# EAGLE design TC_TFT (EAGLE 9.6.2)
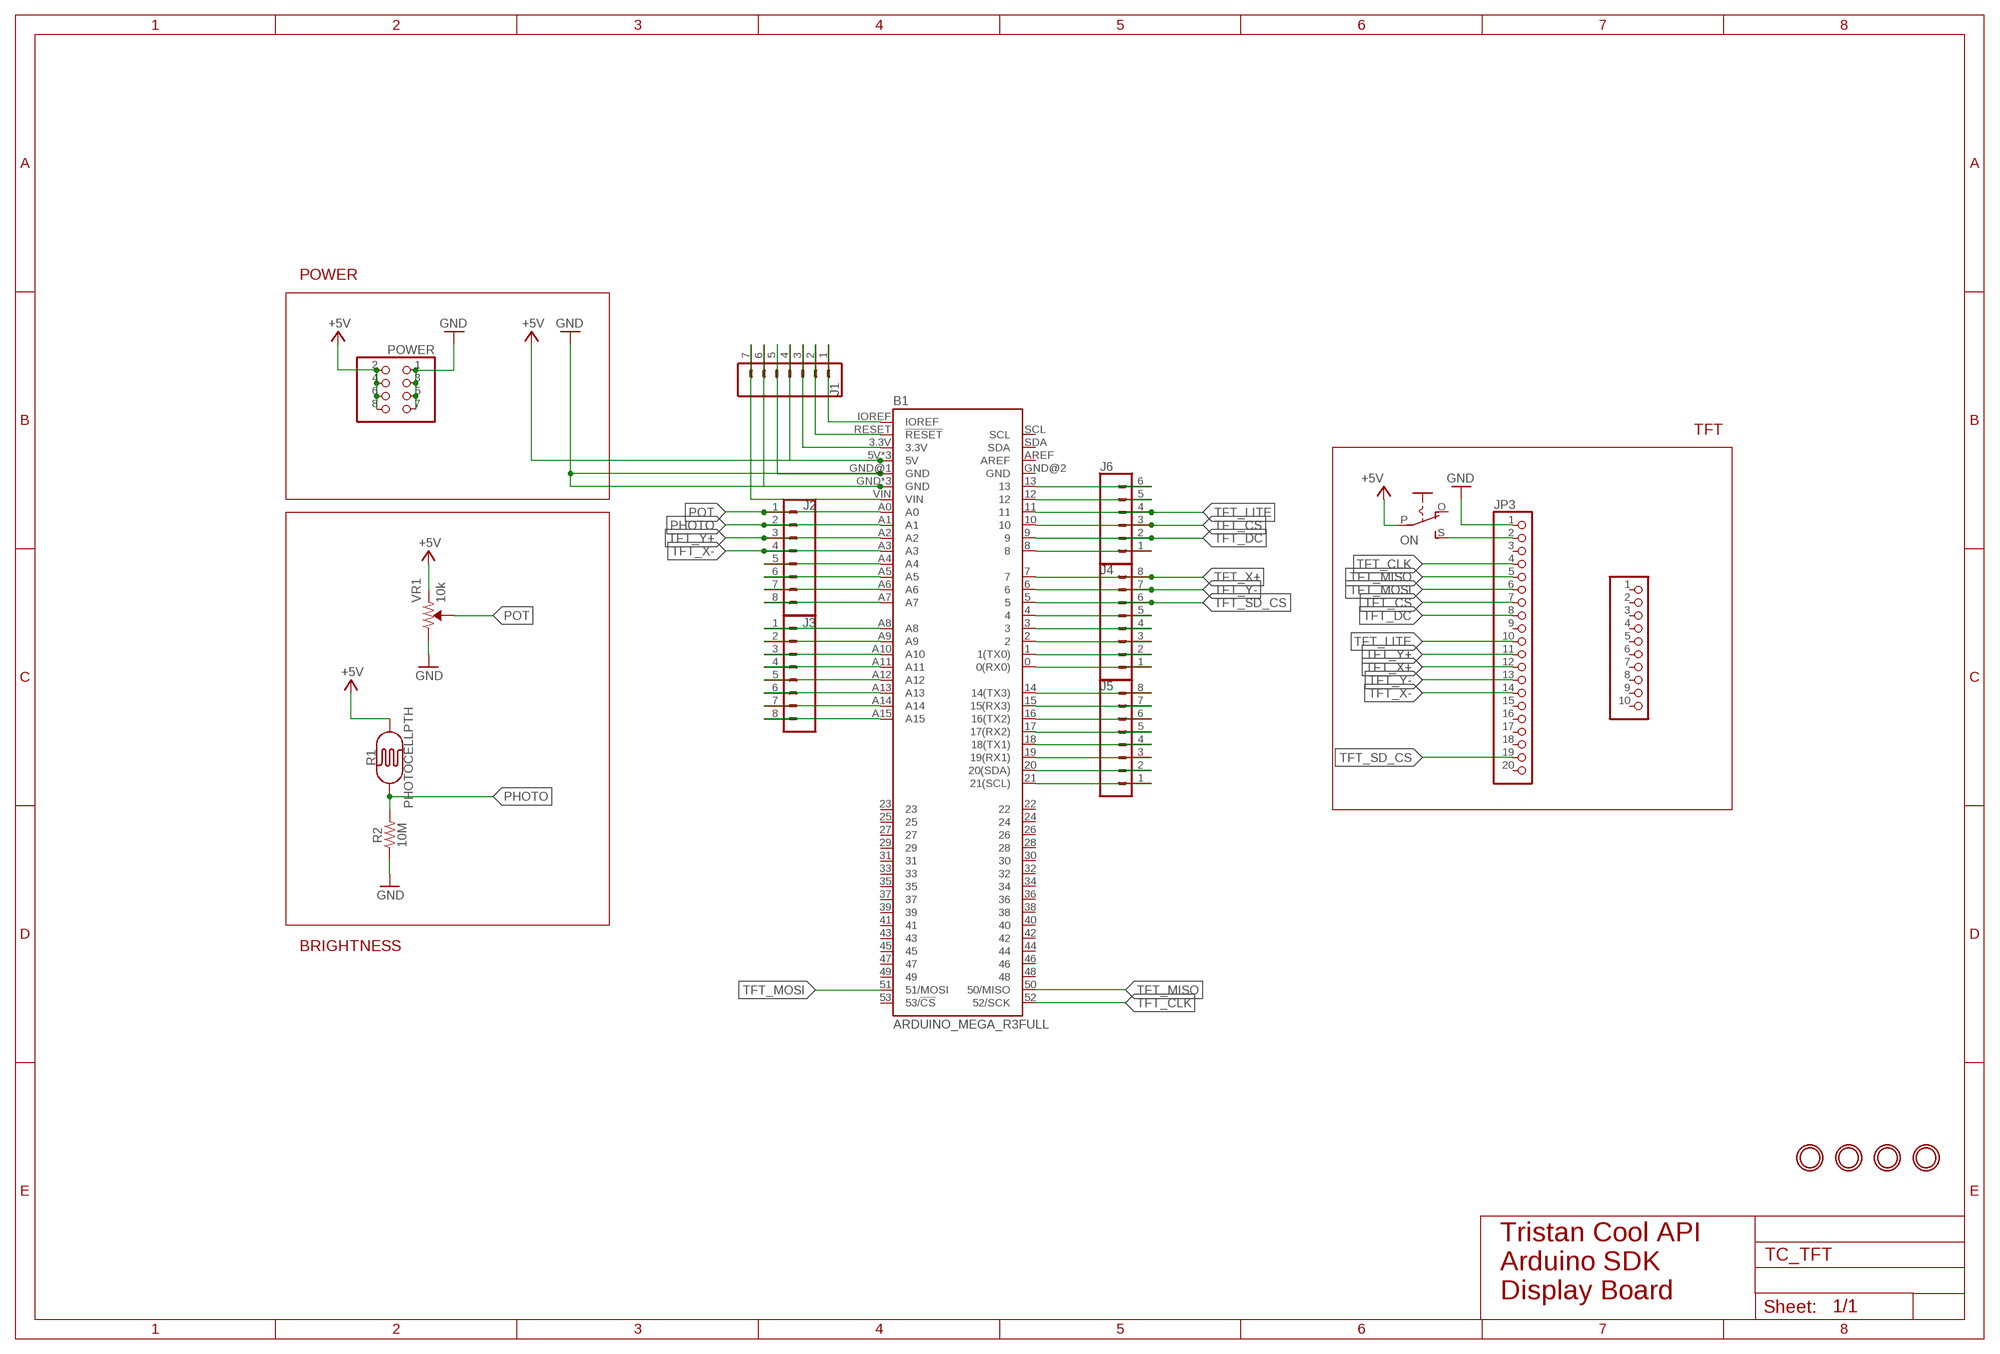
[diagram p0: schematic, sheet 1]

## Parts
B1  ARDUINO_MEGA_R3FULL  [ARDUINO_MEGA_NO_SILK]
J1  CONN_07  [1X07]
J2  CONN_08"  [1X08]
J3  CONN_08"  [1X08]
J4  CONN_08"  [1X08]
J5  CONN_08"  [1X08]
J6  CONN_06SILK_FEMALE_PTH  [1X06]
JP3  HEADER-1X20ROUND  [1X20_ROUND]
ON  EG1218S  [EG1218]
POWER  PINHD-2X4  [2X04]
R1  PHOTOCELLPTH  [PHOTOCELL]
R2  10M  10MOHM-0603-1/10W-5%  [0603]
U$1  MOUNTINGHOLE3.0THIN  [MOUNTINGHOLE_3.0_PLATEDTHIN]
U$2  MOUNTINGHOLE3.0THIN  [MOUNTINGHOLE_3.0_PLATEDTHIN]
U$3  MOUNTINGHOLE3.0THIN  [MOUNTINGHOLE_3.0_PLATEDTHIN]
U$4  MOUNTINGHOLE3.0THIN  [MOUNTINGHOLE_3.0_PLATEDTHIN]
U$5  PINHD-1X10  [1X10-BIG]
VR1  10k  TRIMPOT-PTH-10MM-KNOB-1/2W-10%  [TRIMPOT-PTH-3386U]

## Nets
+5V: B1.5V B1.5V@1(5V) B1.5V@2(5V) J1.4 ON.P POWER.2 POWER.4 POWER.6 POWER.8 R1.2 VR1.1(CCW)
GND: B1.GND B1.GND@1(GND) B1.GND@3(GND) B1.GND@4(GND) J1.5 J1.6 JP3.1 POWER.1 POWER.3 POWER.5 POWER.7 R2.1 VR1.3(CW)
N$7: JP3.2 ON.S
N$8: B1.IOREF J1.1
N$9: B1.RESET(!RESET) J1.2
N$10: B1.3.3V J1.3
N$11: B1.VIN J1.7
N$16: B1.A4 J2.5
N$17: B1.A5 J2.6
N$18: B1.A6 J2.7
N$19: B1.A7 J2.8
N$20: B1.A8 J3.1
N$21: B1.A9 J3.2
N$22: B1.A10 J3.3
N$23: B1.A11 J3.4
N$24: B1.A12 J3.5
N$25: B1.A13 J3.6
N$26: B1.A14 J3.7
N$27: B1.A15 J3.8
N$28: B1.8 J6.1
N$29: B1.12 J6.5
N$30: B1.13 J6.6
N$36: B1.4 J4.5
N$37: B1.3 J4.4
N$38: B1.2 J4.3
N$39: B1.1(1(TX0)) J4.2
N$40: B1.0(0(RX0)) J4.1
N$41: B1.14(14(TX3)) J5.8
N$42: B1.15(15(RX3)) J5.7
N$43: B1.16(16(TX2)) J5.6
N$44: B1.17(17(RX2)) J5.5
N$45: B1.18(18(TX1)) J5.4
N$46: B1.19(19(RX1)) J5.3
N$47: B1.20(20(SDA)) J5.2
N$48: B1.21(21(SCL)) J5.1
PHOTO: B1.A1 J2.2 R1.1 R2.2
POT: B1.A0 J2.1 VR1.2(WIPER)
TFT_CLK: B1.52(52/SCK) JP3.4
TFT_CS: B1.10 J6.3 JP3.7
TFT_DC: B1.9 J6.2 JP3.8
TFT_LITE: B1.11 J6.4 JP3.10
TFT_MISO: B1.50(50/MISO) JP3.5
TFT_MOSI: B1.51(51/MOSI) JP3.6
TFT_SD_CS: B1.5 J4.6 JP3.19
TFT_X+: B1.7 J4.8 JP3.12
TFT_X-: B1.A3 J2.4 JP3.14
TFT_Y+: B1.A2 J2.3 JP3.11
TFT_Y-: B1.6 J4.7 JP3.13
Unconnected: B1.22 B1.23 B1.24 B1.25 B1.26 B1.27 B1.28 B1.29 B1.30 B1.31 B1.32 B1.33 B1.34 B1.35 B1.36 B1.37 B1.38 B1.39 B1.40 B1.41 B1.42 B1.43 B1.44 B1.45 B1.46 B1.47 B1.48 B1.49 B1.53(53/!CS) B1.AREF B1.GND@2(GND) B1.SCL B1.SDA JP3.3 JP3.9 JP3.15 JP3.16 JP3.17 JP3.18 JP3.20 ON.O U$5.1 U$5.2 U$5.3 U$5.4 U$5.5 U$5.6 U$5.7 U$5.8 U$5.9 U$5.10

## Notes on the sheet
- POWER
- TFT
- BRIGHTNESS
- Tristan Cool API 
  Arduino SDK
  Display Board

## Library data of the parts
B1 = SparkFun-Boards:ARDUINO_MEGA_R3: Arduino Mega R3 ATmega2560 R3 compatible footprint. SparkFun Products: Arduino Mega 2560 R3 <https://www.sparkfun.com/products/11061>
J1 = SparkFun-Connectors:CONN_07: Multi connection point. Often used as Generic Header-pin footprint for 0.1 inch spaced/style header connections On any of the 0.1 inch spaced packages, you can populate with these: Break Away Headers - Straight <https://www.sparkfun.com/products/116> (PRT-00116) Break Away Male Headers - Right Angle <https://www.sparkfun.com/products/553> (PRT-00553) Female Headers <https://www.sparkfun.com/products/115> (PRT-00115) Break Away Headers - Machine Pin <https://www.sparkfun.com/products/117> (PRT-00117) Break Away Female Headers - Swiss Machine Pin <https://www.sparkfun.com/products/743> (PRT-00743) For SCREWTERMINALS and SPRING TERMINALS visit here: Screw Terimnals on SparkFun.com <https://www.sparkfun.com/search/results?term=Screw+Terminals> (5mm/3.5mm/2.54mm spacing) This device is also useful as a general connection point to wire up your design to another part of your project. Our various solder wires solder well into these plated through hole pads. Hook-Up Wire - Assortment (Stranded, 22 AWG) <https://www.sparkfun.com/products/11375> (PRT-11375) Hook-Up Wire - Assortment (Solid Core, 22 AWG) <https://www.sparkfun.com/products/11367> (PRT-11367) View the entire wire category on our website here <https://www.sparkfun.com/categories/141> Special notes: Molex polarized connector foot print use with SKU : PRT-08231 with associated crimp pins and housings. 1MM SMD Version SKU: PRT-10208 NOTES ON THE VARIANTS LOCK and LOCK_LONGPADS... This footprint was designed to help hold the alignment of a through-hole component (i.e. 6-pin header) while soldering it into place. You may notice that each hole has been shifted either up or down by 0.005 of an inch from it's more standard position (which is a perfectly straight line). This slight alteration caused the pins (the squares in the middle) to touch the edges of the holes. Because they are alternating, it causes a "brace" to hold the component in place. 0.005 has proven to be the perfect amount of "off-center" position when using our standard breakaway headers. Although looks a little odd when you look at the bare footprint, once you have a header in there, the alteration is very hard to notice. Also,if you push a header all the way into place, it is covered up entirely on the bottom side.
J2-J5 = SparkFun-Connectors:CONN_08: Multi connection point. Often used as Generic Header-pin footprint for 0.1 inch spaced/style header connections On any of the 0.1 inch spaced packages, you can populate with these: Break Away Headers - Straight <https://www.sparkfun.com/products/116> (PRT-00116) Break Away Male Headers - Right Angle <https://www.sparkfun.com/products/553> (PRT-00553) Female Headers <https://www.sparkfun.com/products/115> (PRT-00115) Break Away Headers - Machine Pin <https://www.sparkfun.com/products/117> (PRT-00117) Break Away Female Headers - Swiss Machine Pin <https://www.sparkfun.com/products/743> (PRT-00743) Arduino Stackable Header - 8 Pin <https://www.sparkfun.com/products/9279> (PRT-09279) For SCREWTERMINALS and SPRING TERMINALS visit here: Screw Terimnals on SparkFun.com <https://www.sparkfun.com/search/results?term=Screw+Terminals> (5mm/3.5mm/2.54mm spacing) This device is also useful as a general connection point to wire up your design to another part of your project. Our various solder wires solder well into these plated through hole pads. Hook-Up Wire - Assortment (Stranded, 22 AWG) <https://www.sparkfun.com/products/11375> (PRT-11375) Hook-Up Wire - Assortment (Solid Core, 22 AWG) <https://www.sparkfun.com/products/11367> (PRT-11367) View the entire wire category on our website here <https://www.sparkfun.com/categories/141> Special notes: Molex polarized connector foot print use with SKU : PRT-08231 with associated crimp pins and housings. 1MM SMD Version SKU: PRT-10208 NOTES ON THE VARIANTS LOCK and LOCK_LONGPADS... This footprint was designed to help hold the alignment of a through-hole component (i.e. 6-pin header) while soldering it into place. You may notice that each hole has been shifted either up or down by 0.005 of an inch from it's more standard position (which is a perfectly straight line). This slight alteration caused the pins (the squares in the middle) to touch the edges of the holes. Because they are alternating, it causes a "brace" to hold the component in place. 0.005 has proven to be the perfect amount of "off-center" position when using our standard breakaway headers. Although looks a little odd when you look at the bare footprint, once you have a header in there, the alteration is very hard to notice. Also,if you push a header all the way into place, it is covered up entirely on the bottom side.; PROD_ID: CONN-08438
J6 = SparkFun-Connectors:CONN_06: Multi connection point. Often used as Generic Header-pin footprint for 0.1 inch spaced/style header connections On any of the 0.1 inch spaced packages, you can populate with these: Break Away Headers - Straight <https://www.sparkfun.com/products/116> (PRT-00116) Break Away Male Headers - Right Angle <https://www.sparkfun.com/products/553> (PRT-00553) Female Headers <https://www.sparkfun.com/products/115> (PRT-00115) Break Away Headers - Machine Pin <https://www.sparkfun.com/products/117> (PRT-00117) Break Away Female Headers - Swiss Machine Pin <https://www.sparkfun.com/products/743> (PRT-00743) Arduino Stackable Header - 6 Pin <https://www.sparkfun.com/products/9280> (PRT-09280) For SCREWTERMINALS and SPRING TERMINALS visit here: Screw Terimnals on SparkFun.com <https://www.sparkfun.com/search/results?term=Screw+Terminals> (5mm/3.5mm/2.54mm spacing) This device is also useful as a general connection point to wire up your design to another part of your project. Our various solder wires solder well into these plated through hole pads. Hook-Up Wire - Assortment (Stranded, 22 AWG) <https://www.sparkfun.com/products/11375> (PRT-11375) Hook-Up Wire - Assortment (Solid Core, 22 AWG) <https://www.sparkfun.com/products/11367> (PRT-11367) View the entire wire category on our website here <https://www.sparkfun.com/categories/141>; PROD_ID: CONN-08437
JP3 = microbuilder:HEADER-1X20
ON = adafruit:EG1218: SLIDING SWITCH 0.1" spacing through hole, vertical SPDT slide switch http://www.ladyada.net/library/pcb/eaglelibrary.html
POWER = adafruit:PINHD-2X4: PIN HEADER
R1 = SparkFun-Sensors:PHOTOCELL: Photocell (Photodetector, Photo Resistor, CdS) This is a very small light sensor. A photocell changes (also called a photodetector, photo resistor, CdS or photoconductive cell) resistance depending on the amount of light it is exposed to. These little sensors make great ambient light triggers (when light in the room turns on, do something). Datasheet <http://cdn.sparkfun.com/datasheets/Sensors/LightImaging/SEN-09088.pdf> SparkFun Products Mini Photocell <https://www.sparkfun.com/products/9088> (SEN-09088); PROD_ID: COMP-09129; SF_ID: SEN-09088
R2 = SparkFun-Resistors:10MOHM: RES-09327; PROD_ID: RES-08283
U$1-U$4 = microbuilder:MOUNTINGHOLE: Mounting Hole For #2 screws (0.086"/2.18mm width, 0.094"/2.4mm hole) use 2.5mm; BOM: EXCLUDE
U$5 = adafruit:PINHD-1X10: Pin header 1x10 0.1" spacing With round pins
VR1 = SparkFun-Resistors:TRIMPOT: Trimming Potentiometer (Trimpot) Three-terminal potentiometers, with an adjustable wiper and two adjustable resistors. A pot can be used to create a configurable voltage divider, or as a variable resistor. "Trimpots" are a subset of potentiometers, usually intended for "set-and-forget" applications. They're often more delicate than standard potentiometers - rated for fewer turns. Variants PTH-KNOB - PTH Trimpot w/ finger-adjustable knob Trimpot 10K with Knob <https://www.sparkfun.com/products/9806> (COM-09806) Datasheet <http://www.sparkfun.com/datasheets/Components/General/TSR-3386.pdf> SMD-3MM-CLOSED-FRAME - SMD 3mm Square Closed-Frame Trimpot Used on e.g. EasyDriver - Stepper Motor Driver <https://www.sparkfun.com/products/12779> Datasheet <http://www.bitechnologies.com/pdfs/22.pdf> (22AR10KTR) SMD-5MM - SMD 5mm Square Closed-Frame Trimpot Used on e.g. IOIO-OTG - V2.2 <https://www.sparkfun.com/products/13613> Datasheet <http://www.vishay.com/docs/51008/ts53.pdf> (TS53YL502MR10) SMD-3MM-1/10W-25% - 3mm Square Open-Frame Trimpot Used on e.g. SparkFun Shapeoko <https://www.sparkfun.com/products/13899> Datasheet <http://www.bourns.com/docs/Product-Datasheets/TC33.pdf> (TC33X-2-103E); PROD_ID: RES-09730; SF_SKU: COM-09806

## Board
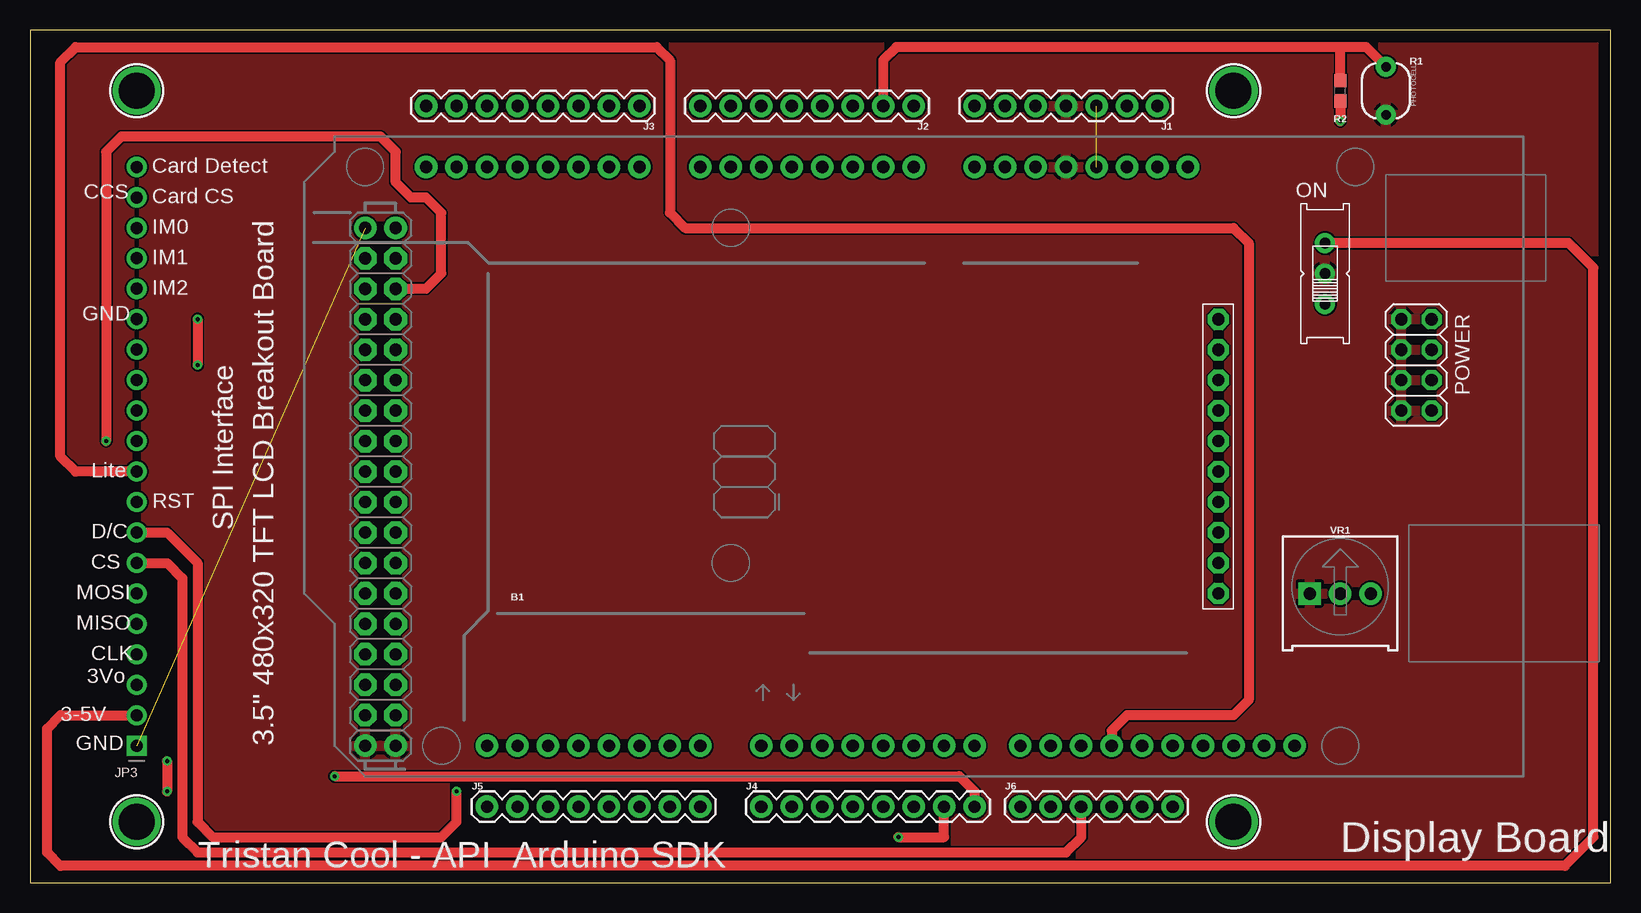
[diagram p1: board, top side]
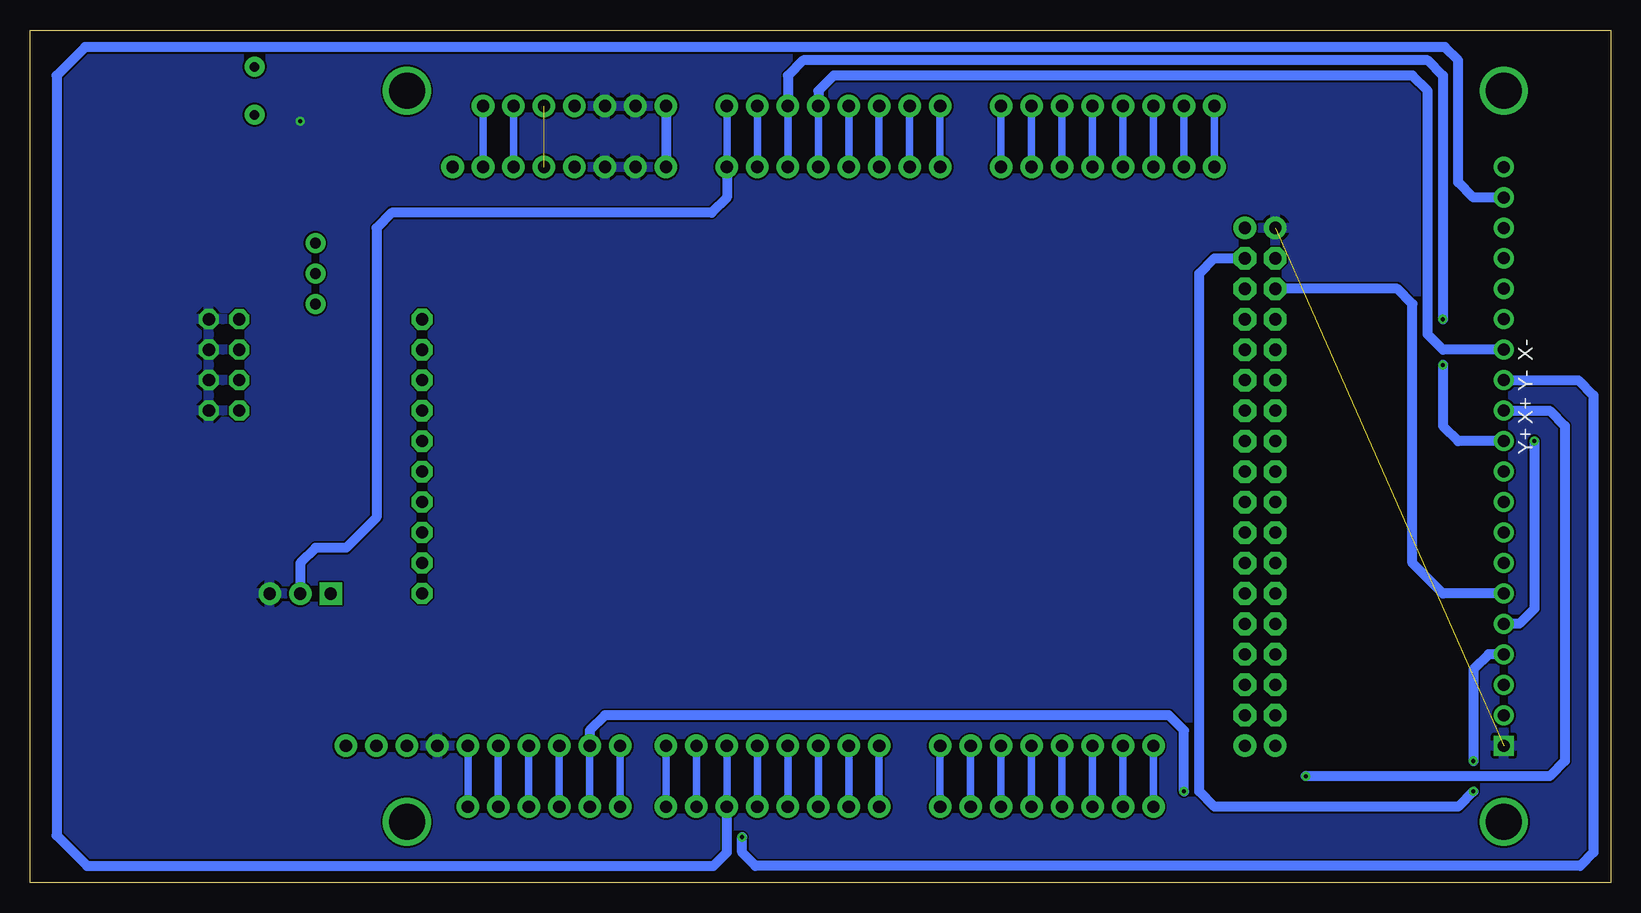
[diagram p2: board, bottom side, seen from below]

Size 131.75 x 71.11 mm. Coordinates in mm from the lower left corner, seen from the top.
Outline: 0,0 131.75,0 131.75,71.11 0,71.11 0,0
Copper layers (1*16): Top 0.035mm / dielectric 1.5mm / Bottom 0.035mm
Design rules "default": minimum track width 6mil, minimum drill 0.35mm, track to track 6mil, track to pad 6mil, pad to pad 6mil, via to via 6mil, smd to smd 6mil, copper to edge 40mil, drill to drill 6mil, minimum pad ring 10mil, minimum via ring 8mil, stop-mask expansion 4mil, vias tented up to drill 0mil, thermal gap 10mil

### Footprints (pad centres in the part's own frame; a part is rotated, then mirrored left to right if it is on the bottom)
ARDUINO_MEGA_NO_SILK = drill 1.016 pad 1.88: 0 13.97,24.13; 1 11.43,24.13; 2 8.89,24.13; 3 6.35,24.13; 3.3V -13.97,-24.13; 4 3.81,24.13; 5 1.27,24.13; 5V -11.43,-24.13; 5V@1 44.45,24.13; 5V@2 46.99,24.13; 6 -1.27,24.13; 7 -3.81,24.13; 8 -7.62,24.13; 9 -10.16,24.13; 10 -12.7,24.13; 11 -15.24,24.13; 12 -17.78,24.13; 13 -20.32,24.13; 14 19.05,24.13; 15 21.59,24.13; 16 24.13,24.13; 17 26.67,24.13; 18 29.21,24.13; 19 31.75,24.13; 20 34.29,24.13; 21 36.83,24.13; A0 1.27,-24.13; A1 3.81,-24.13; A2 6.35,-24.13; A3 8.89,-24.13; A4 11.43,-24.13; A5 13.97,-24.13; A6 16.51,-24.13; A7 19.05,-24.13; A8 24.13,-24.13; A9 26.67,-24.13; A10 29.21,-24.13; A11 31.75,-24.13; A12 34.29,-24.13; A13 36.83,-24.13; A14 39.37,-24.13; A15 41.91,-24.13; AREF -25.4,24.13; GND -8.89,-24.13; GND@1 -6.35,-24.13; GND@2 44.45,-19.05; GND@3 46.99,-19.05; GND@4 -22.86,24.13; IOREF -19.05,-24.13; NC -21.59,-24.13; RESET -16.51,-24.13; SCL -30.48,24.13; SDA -27.94,24.13; VIN -3.81,-24.13 | drill 1.016 pad 1.88 octagon: 22 44.45,21.59; 23 46.99,21.59; 24 44.45,19.05; 25 46.99,19.05; 26 44.45,16.51; 27 46.99,16.51; 28 44.45,13.97; 29 46.99,13.97; 30 44.45,11.43; 31 46.99,11.43; 32 44.45,8.89; 33 46.99,8.89; 34 44.45,6.35; 35 46.99,6.35; 36 44.45,3.81; 37 46.99,3.81; 38 44.45,1.27; 39 46.99,1.27; 40 44.45,-1.27; 41 46.99,-1.27; 42 44.45,-3.81; 43 46.99,-3.81; 44 44.45,-6.35; 45 46.99,-6.35; 46 44.45,-8.89; 47 46.99,-8.89; 48 44.45,-11.43; 49 46.99,-11.43; 50 44.45,-13.97; 51 46.99,-13.97; 52 44.45,-16.51; 53 46.99,-16.51
1X07 = drill 1.016 pad 1.88: 1 0,0; 2 2.54,0; 3 5.08,0; 4 7.62,0; 5 10.16,0; 6 12.7,0; 7 15.24,0
1X08 = drill 1.016 pad 1.88: 1 0,0; 2 2.54,0; 3 5.08,0; 4 7.62,0; 5 10.16,0; 6 12.7,0; 7 15.24,0; 8 17.78,0
1X06 = drill 1.016 pad 1.88: 1 0,0; 2 2.54,0; 3 5.08,0; 4 7.62,0; 5 10.16,0; 6 12.7,0
1X20_ROUND = drill 1 pad 1.676 square: 1 -24.13,0 | drill 1 pad 1.676: 2 -21.59,0; 3 -19.05,0; 4 -16.51,0; 5 -13.97,0; 6 -11.43,0; 7 -8.89,0; 8 -6.35,0; 9 -3.81,0; 10 -1.27,0; 11 1.27,0; 12 3.81,0; 13 6.35,0; 14 8.89,0; 15 11.43,0; 16 13.97,0; 17 16.51,0; 18 19.05,0; 19 21.59,0; 20 24.13,0
EG1218 = drill 0.9 pad 1.676: O -2.54,0; P 0,0; S 2.54,0
2X04 = drill 1.016 pad 1.676 octagon: 1 -3.81,-1.27; 2 -3.81,1.27; 3 -1.27,-1.27; 4 -1.27,1.27; 5 1.27,-1.27; 6 1.27,1.27; 7 3.81,-1.27; 8 3.81,1.27
PHOTOCELL = drill 0.8 pad 1.676: 1 -2,0; 2 2,0
0603 = smd 1.1 x 1: 1 -0.85,0; 2 0.85,0
MOUNTINGHOLE_3.0_PLATEDTHIN = drill 3 pad 3.6: P$1 0,0
1X10-BIG = drill 1.016 pad 1.778 octagon: 1 -11.43,0; 2 -8.89,0; 3 -6.35,0; 4 -3.81,0; 5 -1.27,0; 6 1.27,0; 7 3.81,0; 8 6.35,0; 9 8.89,0; 10 11.43,0
TRIMPOT-PTH-3386U = drill 1.016 pad 1.88 square: 1 -2.54,-0.015 | drill 1.016 pad 1.88: 2 0,-0.015; 3 2.54,-0.015

### Placement (x,y rotation side)
B1  74.93,35.56 180 top
J1  93.98,64.77 180 top
J2  73.66,64.77 180 top
J3  50.8,64.77 180 top
J4  60.96,6.35 0 top
J5  38.1,6.35 0 top
J6  82.55,6.35 0 top
JP3  8.89,35.56 90 top
ON  107.95,50.8 90 top
POWER  115.57,43.18 90 top
R1  113.03,66.04 270 top
R2  109.22,66.04 90 top
U$1  8.89,66.04 270 top
U$2  8.89,5.08 270 top
U$3  100.33,66.04 270 top
U$4  100.33,5.08 270 top
U$5  99.06,35.56 90 top
VR1  109.22,24.13 0 top

### Tracks (layer width: path | path; a pad name or v marks a point on that pad's centre or on a via)
+5V
  pour Top: 0,0 0,71.12 132.08,71.12 132.08,69.85 132.08,0 128.27,0
GND  (via drill 0.35)  (1 unrouted)
  Top 0.813: R2.1 v109.22,63.5
  pour Bottom: 0,0 0,71.12 132.08,71.12 132.08,0 130.81,0
N$7
  Top 0.813: ON.S 128.27,53.34 130.33,51.28 130.33,3.81 127.94,1.42 2.54,1.42 1.42,2.54 1.42,12.85 2.54,13.97 JP3.2
N$8
  Bottom 0.61: J1.1 B1.IOREF
N$9
  Bottom 0.61: J1.2 B1.RESET
N$10  (1 unrouted)
N$11
  Bottom 0.813: J1.7 B1.VIN
N$16
  Bottom 0.61: J2.5 B1.A4
N$17
  Bottom 0.61: J2.6 B1.A5
N$18
  Bottom 0.61: J2.7 B1.A6
N$19
  Bottom 0.61: J2.8 B1.A7
N$20
  Bottom 0.61: J3.1 B1.A8
N$21
  Bottom 0.61: J3.2 B1.A9
N$22
  Bottom 0.61: J3.3 B1.A10
N$23
  Bottom 0.61: J3.4 B1.A11
N$24
  Bottom 0.61: J3.5 B1.A12
N$25
  Bottom 0.61: J3.6 B1.A13
N$26
  Bottom 0.61: J3.7 B1.A14
N$27
  Bottom 0.61: J3.8 B1.A15
N$28
  Bottom 0.61: B1.8 J6.1
N$29
  Bottom 0.61: B1.12 J6.5
N$30
  Bottom 0.61: B1.13 J6.6
N$36
  Bottom 0.61: B1.4 J4.5
N$37
  Bottom 0.61: B1.3 J4.4
N$38
  Bottom 0.61: B1.2 J4.3
N$39
  Bottom 0.61: B1.1 J4.2
N$40
  Bottom 0.61: B1.0 J4.1
N$41
  Bottom 0.61: B1.14 J5.8
N$42
  Bottom 0.61: B1.15 J5.7
N$43
  Bottom 0.61: B1.16 J5.6
N$44
  Bottom 0.61: B1.17 J5.5
N$45
  Bottom 0.61: B1.18 J5.4
N$46
  Bottom 0.61: B1.19 J5.3
N$47
  Bottom 0.61: B1.20 J5.2
N$48
  Bottom 0.61: B1.21 J5.1
PHOTO
  Top 0.813: R2.2 109.22,69.69 | J2.2 71.12,68.58 72.23,69.69 109.22,69.69 | R1.1 111.38,69.69 109.22,69.69
  Bottom 0.61: J2.2 B1.A1
POT
  Bottom 0.61: J2.1 B1.A0
  Bottom 0.813: B1.A0 73.66,57.15 74.93,55.88 101.6,55.88 102.87,54.61 102.87,30.48 105.41,27.94 107.95,27.94 109.22,26.67 VR1.2
TFT_CLK  (via drill 0.35)
  Top 0.813: v11.43,10.16 v11.43,7.62
  Bottom 0.813: JP3.4 10.16,19.05 11.43,17.78 v11.43,10.16 | v11.43,7.62 12.7,6.35 33.02,6.35 34.29,7.62 34.29,50.8 33.02,52.07 B1.52
TFT_CS
  Top 0.813: JP3.7 11.43,26.67 12.7,25.4 12.7,3.81 13.97,2.54 86.36,2.54 87.63,3.81 J6.3
  Bottom 0.61: B1.10 J6.3
TFT_DC  (via drill 0.35)
  Top 0.813: JP3.8 11.43,29.21 13.97,26.67 13.97,5.08 15.24,3.81 34.29,3.81 35.56,5.08 v35.56,7.62
  Bottom 0.61: B1.9 J6.2
  Bottom 0.813: v35.56,7.62 35.56,12.7 36.83,13.97 83.82,13.97 85.09,12.7 B1.9
TFT_LITE
  Top 0.813: JP3.10 3.81,34.29 2.54,35.56 2.54,68.42 3.81,69.69 52.23,69.69 53.34,68.58 53.34,55.88 54.61,54.61 100.33,54.61 101.6,53.34 101.6,15.24 100.33,13.97 91.44,13.97 90.17,12.7 B1.11
  Bottom 0.61: B1.11 J6.4
TFT_MISO  (via drill 0.35)
  Top 0.813: B1.50 33.02,49.53 34.29,50.8 34.29,55.88 33.02,57.15 31.75,57.15 30.48,58.42 30.48,60.96 29.21,62.23 7.62,62.23 6.35,60.96 v6.35,36.83
  Bottom 0.813: v6.35,36.83 6.35,22.86 7.62,21.59 JP3.5
TFT_MOSI
  Bottom 0.813: JP3.6 13.97,24.13 16.51,26.67 16.51,48.26 17.78,49.53 B1.51
TFT_SD_CS
  Bottom 0.61: B1.5 J4.6
  Bottom 0.813: JP3.19 11.43,57.15 12.7,58.42 12.7,68.58 13.81,69.69 127.16,69.69 129.54,67.31 129.54,3.96 127,1.42 74.78,1.42 73.66,2.54 J4.6
TFT_X+  (via drill 0.35)
  Top 0.813: v25.4,8.89 77.47,8.89 78.74,7.62 J4.8
  Bottom 0.61: B1.7 J4.8
  Bottom 0.813: JP3.12 5.08,39.37 3.81,38.1 3.81,10.16 5.08,8.89 v25.4,8.89
TFT_X-
  Bottom 0.61: J2.4 B1.A3
  Bottom 0.813: J2.4 66.04,66.04 64.77,67.31 16.51,67.31 15.24,66.04 15.24,45.72 13.97,44.45 JP3.14
TFT_Y+  (via drill 0.35)
  Top 0.813: v13.97,46.99 v13.97,43.18
  Bottom 0.61: J2.3 B1.A2
  Bottom 0.813: JP3.11 12.7,36.83 13.97,38.1 v13.97,43.18 | J2.3 68.58,67.31 67.31,68.58 15.24,68.58 13.97,67.31 v13.97,46.99
TFT_Y-  (via drill 0.35)
  Top 0.813: v72.39,3.81 76.2,3.81 J4.7
  Bottom 0.61: B1.6 J4.7
  Bottom 0.813: v72.39,3.81 72.39,2.54 71.27,1.42 2.54,1.42 1.42,2.54 1.42,40.64 2.69,41.91 JP3.13

### Text on the board
tPlace: Card Detect | CCS | Card CS | 3.5" 480x320 TFT LCD Breakout Board | IM0 | IM1 | IM2 | GND | SPI Interface | Lite | RST | D/C | CS | MOSI | MISO | CLK | 3Vo | 3-5V | GND
bPlace: X- | Y- | X+ | Y+
tNames: PHOTOCELL | Display Board | Tristan Cool - API Arduino SDK